# EAGLE schematic CANIO (EAGLE 8.2.2)
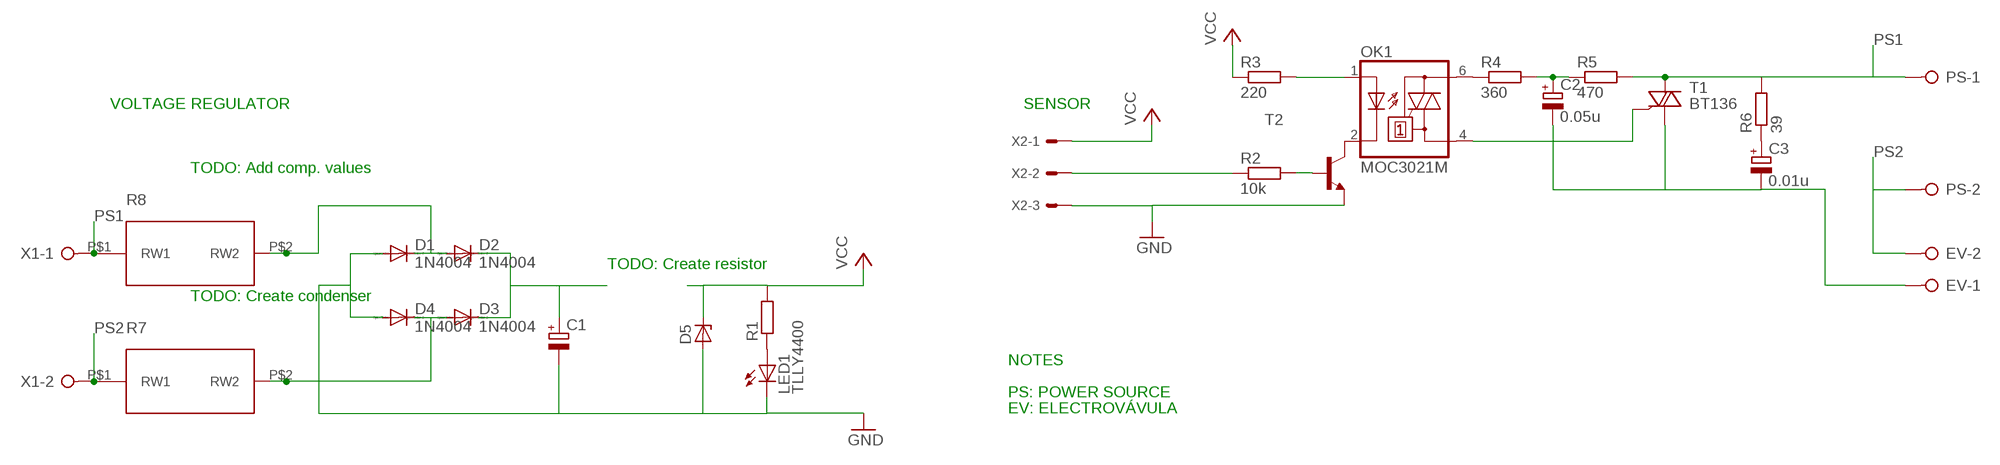
[diagram p0: schematic, sheet 1]

## Parts
C1  CPOL-EUB45181A  [B45181A]
C2  0.05u  CPOL-EUB45181A  [B45181A]
C3  0.01u  CPOL-EUB45181A  [B45181A]
D1  1N4004  [DO41-10]
D2  1N4004  [DO41-10]
D3  1N4004  [DO41-10]
D4  1N4004  [DO41-10]
D5  ZENER-DIODEDO34-7  [DO34Z7]
EV  W237-02P  [W237-132]
LED1  TLLY4400  [LED3MM]
OK1  MOC3021M  [DIL06]
PS  W237-02P  [W237-132]
R1  R-EU_0204/5  [0204/5]
R2  10k  R-EU_0204/7  [0204/7]
R3  220  R-EU_0204/7  [0204/7]
R4  360  R-EU_0204/7  [0204/7]
R5  470  R-EU_0204/7  [0204/7]
R6  39  R-EU_0204/7  [0204/7]
R7  RESISTOR1W  [RESISTOR1W]
R8  RESISTOR1W  [RESISTOR1W]
T1  BT136  [TO220AB]
T2  -NPN-TO92  [TO92]
X1  W237-02P  [W237-132]
X2  KK-156-3  [KK-156-3]

## Nets
GND: C1.- D1.A D4.A D5.A LED1.K(C) T2.1(E) X2.3
N$1: D3.A D4.C R7.P$2(RW2)
N$2: D1.C D2.A R8.P$2(RW2)
N$3: C1.+ D2.C D3.C
N$4: R2.1 X2.2
N$5: R2.2 T2.2(B)
N$6: LED1.A R1.1
N$7: OK1.2(C) T2.3(C)
N$8: OK1.1(A) R3.2
N$9: OK1.6(A2) R4.1
N$10: C2.+ R4.2 R5.1
N$12: OK1.4(A1) T1.3(G)
N$13: C3.+ R6.1
N$14: C2.- C3.- EV.1 T1.1(A1)
PS1: PS.1 R5.2 R6.2 R8.P$1(RW1) T1.2(A2) X1.1
PS2: EV.2 PS.2 R7.P$1(RW1) X1.2
VCC: D5.C R1.2 R3.1 X2.1

## Notes on the sheet
- VOLTAGE REGULATOR | SENSOR
- TODO: Add comp. values
- TODO: Create resistor
- TODO: Create condenser
- NOTES
- PS: POWER SOURCE
- EV: ELECTROVÁVULA

## Library data of the parts
C1-C3 = rcl:CPOL-EU: POLARIZED CAPACITOR, European symbol
D1-D4 = diode:1N4004: DIODE general purpose rectifier, 1 A
D5 = diode:ZENER-DIODE: Z-Diode
EV PS X1 = con-wago-508:W237-02P: WAGO SREW CLAMP; OC_FARNELL: unknown; OC_NEWARK: unknown
LED1 = led:TLLY4400: Low Current (2mA) LED 3 mm Tinted Diffused Package color YELLOW Source: Data sheet <http://www.farnell.com/datasheets/391098.pdf>; MF: VISHAY SEMICONDUCTOR; OC_FARNELL: 1612439
OK1 = optocoupler:MOC30*M: RANDOM-PHASE OPTOISOLATORS TRIAC DRIVER OUTPUT Source: http://www.fairchildsemi.com MOC3020-M.pdf; MF: FAIRCHILD SEMICONDUCTOR; MPN: MOC3021-M; OC_FARNELL: 1021365; OC_NEWARK: 95B7895
R1 R4-R6 = rcl:R-EU_: RESISTOR, European symbol
R2 R3 = resistor:R-EU_: RESISTOR, European symbol
R7 R8 = Resistor1W:RESISTOR1W
T1 = triac:BT136: Triac BT136 series E sensitive gate Source: http://www.nxp.com/acrobat_download/datasheets/BT136_SERIES_E_2.pdf
T2 = transistor:*-NPN-: NPN Transistror BF959 corrected 2008.03.06
X2 = con-molex:KK-156-3: KK 156 HEADER Source: http://www.molex.com/pdm_docs/sd/026604100_sd.pdf; OC_FARNELL: unknown; OC_NEWARK: unknown